# EAGLE schematic uCsamd21 (EAGLE 8.7.1)
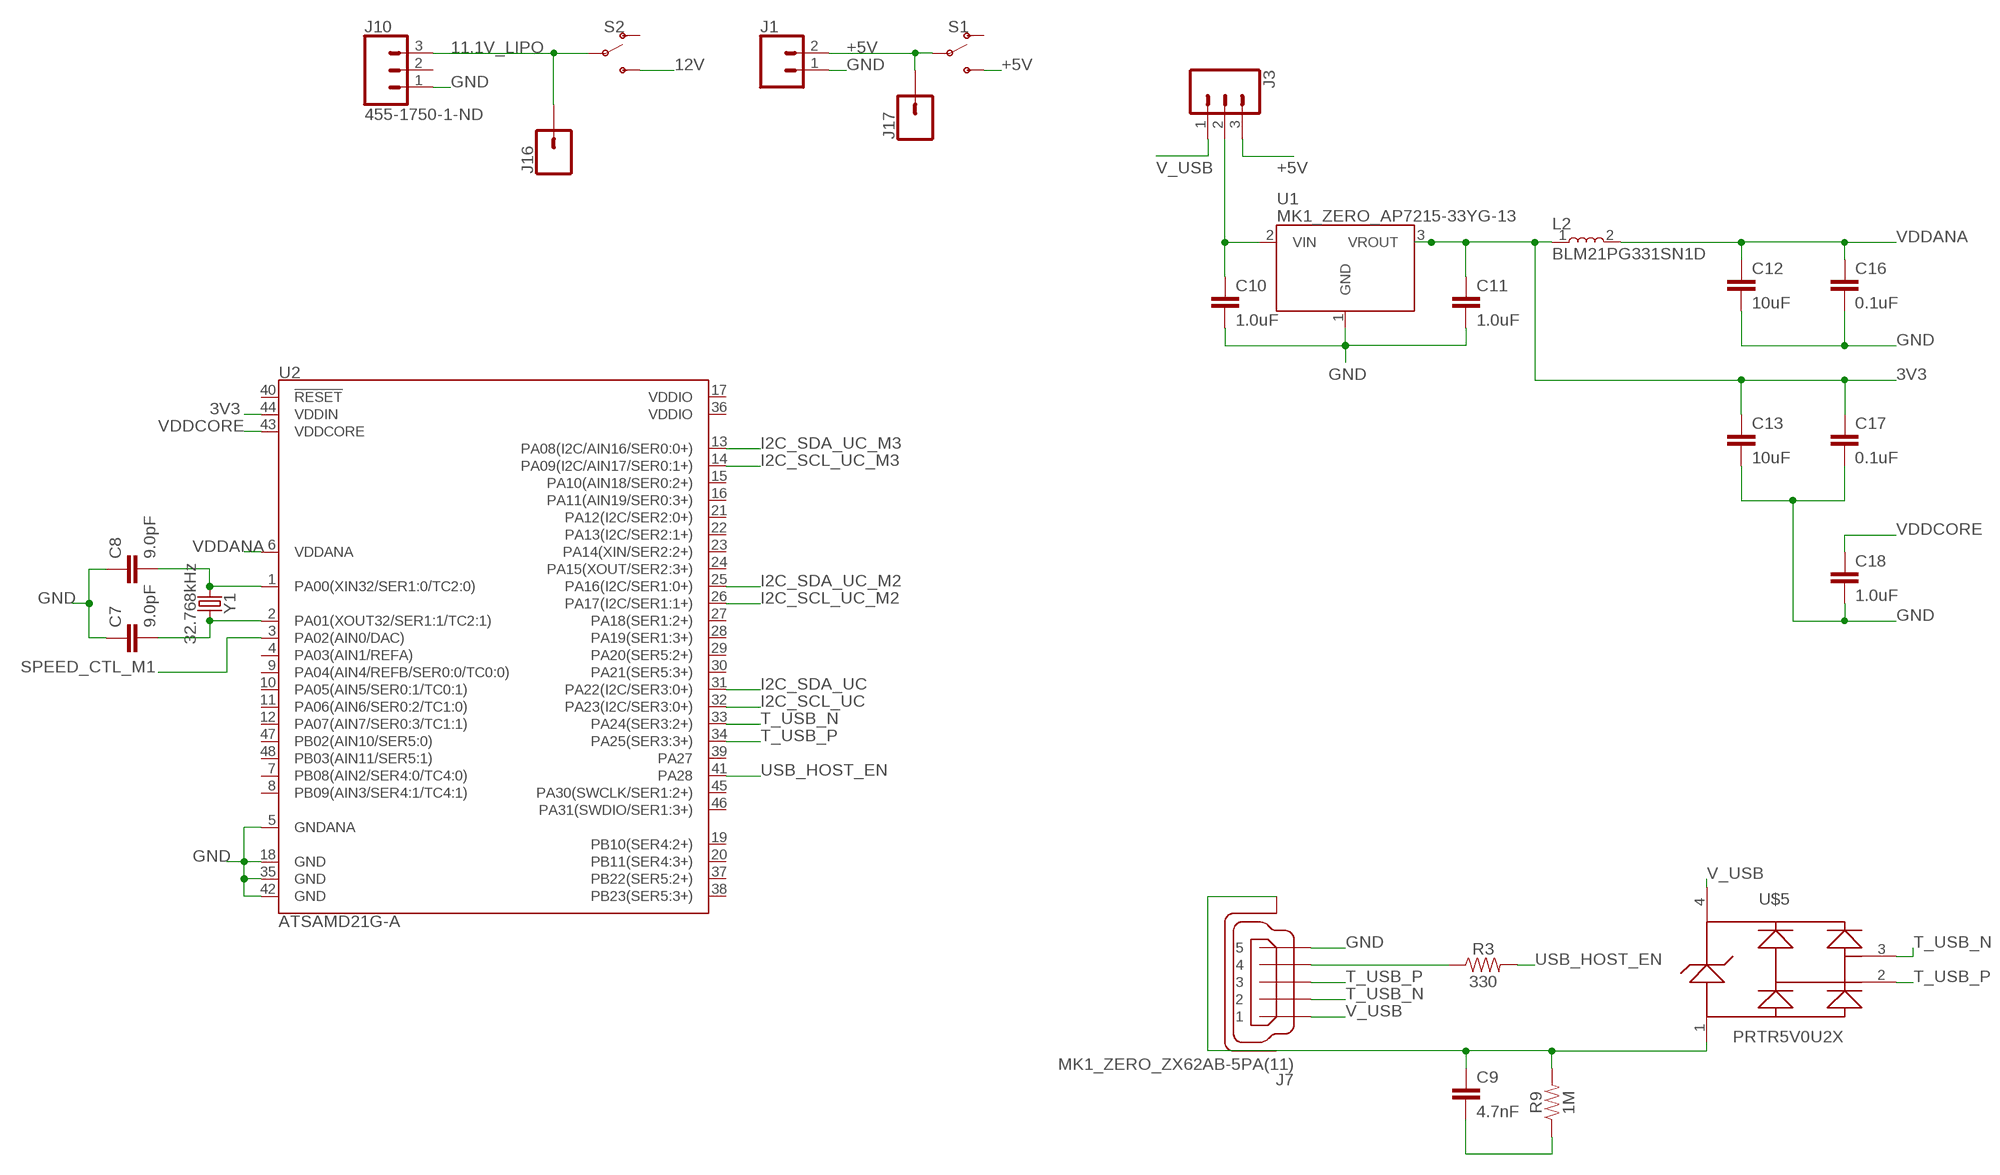
[diagram p0: schematic, sheet 1]

## Parts
C7  9.0pF  9.0PF-0603-50V-10%  [0603]
C8  9.0pF  9.0PF-0603-50V-10%  [0603]
C9  4.7nF  4.7PF-0603-50V-5%  [0603]
C10  1.0uF  1.0UF-0805-25V-(+80/-20%)  [0805]
C11  1.0uF  1.0UF-0805-25V-(+80/-20%)  [0805]
C12  10uF  10UF-0805-10V-10%  [0805]
C13  10uF  10UF-0805-10V-10%  [0805]
C16  0.1uF  1.0UF-0805-25V-(+80/-20%)  [0805]
C17  0.1uF  1.0UF-0805-25V-(+80/-20%)  [0805]
C18  1.0uF  1.0UF-0805-25V-(+80/-20%)  [0805]
J1  CONN_02LOCK_LONGPADS  [1X02_LOCK_LONGPADS]
J3  CONN_03LOCK_LONGPADS  [1X03_LOCK_LONGPADS]
J7  MK1_ZERO_ZX62AB-5PA(11)  [MK1_ZERO_USBMICRO-ZX62-AB-5PA]
J10  455-1750-1-ND  CONN_03  [1X03]
J16  CONN_01  [1X01]
J17  CONN_01  [1X01]
L2  BLM21PG331SN1D  [INDC2012X87]
R3  330  330OHM-0603-1/10W-1%  [0603]
R9  1M  1MOHM-0603-1/4W-5%  [0603]
S1  SWITCH-SPDT-PTH-11.6X4.0MM  [SWITCH_SPDT_PTH_11.6X4.0MM]
S2  SWITCH-SPDT-PTH-11.6X4.0MM  [SWITCH_SPDT_PTH_11.6X4.0MM]
U1  MK1_ZERO_AP7215-33YG-13  [MK1_ZERO_SOT150P400X160-3N]
U2  ATSAMD21G-A  [TQFP-48]
U$5  ARDUINO_PRTR5V0U2XB  [ARDUINO_SOT143B]
Y1  32.768kHz  CRYSTAL-32.768KHZSMD-3.2X1.5  [CRYSTAL-SMD-3.2X1.5MM]

## Nets
3V3: C11.1 C13.1 C17.1 L2.1 U1.3(VROUT) U2.44(VDDIN)
11.1V_LIPO: J10.3 J16.1 S2.2(P)
12V: S2.3(S)
+5V: J1.2 J3.3 J17.1 S1.2(P) S1.3(S)
GND: C7.1 C8.1 C10.2 C11.2 C12.2 C13.2 C16.2 C17.2 C18.2 J1.1 J7.5 J10.1 U1.1(GND) U2.5(GNDANA) U2.18(GND) U2.35(GND) U2.42(GND)
I2C_SCL_UC: U2.32(PA23(I2C/SER3:0+))
I2C_SCL_UC_M2: U2.26(PA17(I2C/SER1:1+))
I2C_SCL_UC_M3: U2.14(PA09(I2C/AIN17/SER0:1+))
I2C_SDA_UC: U2.31(PA22(I2C/SER3:0+))
I2C_SDA_UC_M2: U2.25(PA16(I2C/SER1:0+))
I2C_SDA_UC_M3: U2.13(PA08(I2C/AIN16/SER0:0+))
N$8: C7.2 U2.2(PA01(XOUT32/SER1:1/TC2:1)) Y1.P$2
N$10: C8.2 U2.1(PA00(XIN32/SER1:0/TC2:0)) Y1.P$1
N$12: J7.4
N$17: C9.1 J7.6(SH) J7.7(SH) J7.8(SH) J7.9(SH) J7.10(SH) J7.11(SH) R9.2 U$5.1
N$19: C9.2 R9.1
N$20: C10.1 J3.2 U1.2(VIN)
N$21: R3.1
SPEED_CTL_M1: U2.3(PA02(AIN0/DAC))
T_USB_N: J7.2 U2.33(PA24(SER3:2+)) U$5.3
T_USB_P: J7.3 U2.34(PA25(SER3:3+)) U$5.2
USB_HOST_EN: R3.2 U2.41(PA28)
V_USB: J3.1 J7.1 U$5.4
VDDANA: C12.1 C16.1 L2.2 U2.6(VDDANA)
VDDCORE: C18.1 U2.43(VDDCORE)
Unconnected: J10.2 S1.1(O) S2.1(O) U2.4(PA03(AIN1/REFA)) U2.7(PB08(AIN2/SER4:0/TC4:0)) U2.8(PB09(AIN3/SER4:1/TC4:1)) U2.9(PA04(AIN4/REFB/SER0:0/TC0:0)) U2.10(PA05(AIN5/SER0:1/TC0:1)) U2.11(PA06(AIN6/SER0:2/TC1:0)) U2.12(PA07(AIN7/SER0:3/TC1:1)) U2.15(PA10(AIN18/SER0:2+)) U2.16(PA11(AIN19/SER0:3+)) U2.17(VDDIO) U2.19(PB10(SER4:2+)) U2.20(PB11(SER4:3+)) U2.21(PA12(I2C/SER2:0+)) U2.22(PA13(I2C/SER2:1+)) U2.23(PA14(XIN/SER2:2+)) U2.24(PA15(XOUT/SER2:3+)) U2.27(PA18(SER1:2+)) U2.28(PA19(SER1:3+)) U2.29(PA20(SER5:2+)) U2.30(PA21(SER5:3+)) U2.36(VDDIO) U2.37(PB22(SER5:2+)) U2.38(PB23(SER5:3+)) U2.39(PA27) U2.40(!RESET!) U2.45(PA30(SWCLK/SER1:2+)) U2.46(PA31(SWDIO/SER1:3+)) U2.47(PB02(AIN10/SER5:0)) U2.48(PB03(AIN11/SER5:1))

## Library data of the parts
C7 C8 = SparkFun-Capacitors:9.0PF: 9.0pF ceramic capacitors A capacitor is a passive two-terminal electrical component used to store electrical energy temporarily in an electric field.; PROD_ID: CAP-09341
C9 = SparkFun-Capacitors:4.7PF: 4.7pF ceramic capacitors A capacitor is a passive two-terminal electrical component used to store electrical energy temporarily in an electric field.; PROD_ID: CAP-07880; VALUE: 4.7pF
C10 C11 C18 = SparkFun-Capacitors:1.0UF: 1µF ceramic capacitors A capacitor is a passive two-terminal electrical component used to store electrical energy temporarily in an electric field.; PROD_ID: CAP-11625
C12 C13 = SparkFun-Capacitors:10UF: 10.0µF ceramic capacitors A capacitor is a passive two-terminal electrical component used to store electrical energy temporarily in an electric field.; PROD_ID: CAP-11330
C16 C17 = SparkFun-Capacitors:1.0UF: 1µF ceramic capacitors A capacitor is a passive two-terminal electrical component used to store electrical energy temporarily in an electric field.; PROD_ID: CAP-11625; VALUE: 1.0uF
J1 = SparkFun-Connectors:CONN_02: Multi connection point. Often used as Generic Header-pin footprint for 0.1 inch spaced/style header connections On any of the 0.1 inch spaced packages, you can populate with these: Break Away Headers - Straight <https://www.sparkfun.com/products/116> (PRT-00116) Break Away Male Headers - Right Angle <https://www.sparkfun.com/products/553> (PRT-00553) Female Headers <https://www.sparkfun.com/products/115> (PRT-00115) Break Away Headers - Machine Pin <https://www.sparkfun.com/products/117> (PRT-00117) Break Away Female Headers - Swiss Machine Pin <https://www.sparkfun.com/products/743> (PRT-00743) For SCREWTERMINALS and SPRING TERMINALS visit here: Screw Terimnals on SparkFun.com <https://www.sparkfun.com/search/results?term=Screw+Terminals> (5mm/3.5mm/2.54mm spacing) This device is also useful as a general connection point to wire up your design to another part of your project. Our various solder wires solder well into these plated through hole pads. Hook-Up Wire - Assortment (Stranded, 22 AWG) <https://www.sparkfun.com/products/11375> (PRT-11375) Hook-Up Wire - Assortment (Solid Core, 22 AWG) <https://www.sparkfun.com/products/11367> (PRT-11367) View the entire wire category on our website here <https://www.sparkfun.com/categories/141> Special notes: Molex polarized connector foot print use with: PRT-08233 with associated crimp pins and housings. 2.54_SCREWTERM for use with PRT-10571. 3.5mm Screw Terminal footprints for PRT-08084 5mm Screw Terminal footprints for use with PRT-08432
J3 = SparkFun-Connectors:CONN_03: Multi connection point. Often used as Generic Header-pin footprint for 0.1 inch spaced/style header connections On any of the 0.1 inch spaced packages, you can populate with these: Break Away Headers - Straight <https://www.sparkfun.com/products/116> (PRT-00116) Break Away Male Headers - Right Angle <https://www.sparkfun.com/products/553> (PRT-00553) Female Headers <https://www.sparkfun.com/products/115> (PRT-00115) Break Away Headers - Machine Pin <https://www.sparkfun.com/products/117> (PRT-00117) Break Away Female Headers - Swiss Machine Pin <https://www.sparkfun.com/products/743> (PRT-00743) Stackable Header - 3 Pin (Female, 0.1") <https://www.sparkfun.com/products/13875> (PRT-13875) For SCREWTERMINALS and SPRING TERMINALS visit here: Screw Terimnals on SparkFun.com <https://www.sparkfun.com/search/results?term=Screw+Terminals> (5mm/3.5mm/2.54mm spacing) This device is also useful as a general connection point to wire up your design to another part of your project. Our various solder wires solder well into these plated through hole pads. Hook-Up Wire - Assortment (Stranded, 22 AWG) <https://www.sparkfun.com/products/11375> (PRT-11375) Hook-Up Wire - Assortment (Solid Core, 22 AWG) <https://www.sparkfun.com/products/11367> (PRT-11367) View the entire wire category on our website here <https://www.sparkfun.com/categories/141> Special notes: Molex polarized connector foot print use with SKU : PRT-08232 with associated crimp pins and housings.
J7 = MKRZero_V5.0:MK1_ZERO_ZX62AB-5PA(11)
J10 = SparkFun-Connectors:CONN_03: Multi connection point. Often used as Generic Header-pin footprint for 0.1 inch spaced/style header connections On any of the 0.1 inch spaced packages, you can populate with these: Break Away Headers - Straight <https://www.sparkfun.com/products/116> (PRT-00116) Break Away Male Headers - Right Angle <https://www.sparkfun.com/products/553> (PRT-00553) Female Headers <https://www.sparkfun.com/products/115> (PRT-00115) Break Away Headers - Machine Pin <https://www.sparkfun.com/products/117> (PRT-00117) Break Away Female Headers - Swiss Machine Pin <https://www.sparkfun.com/products/743> (PRT-00743) Stackable Header - 3 Pin (Female, 0.1") <https://www.sparkfun.com/products/13875> (PRT-13875) For SCREWTERMINALS and SPRING TERMINALS visit here: Screw Terimnals on SparkFun.com <https://www.sparkfun.com/search/results?term=Screw+Terminals> (5mm/3.5mm/2.54mm spacing) This device is also useful as a general connection point to wire up your design to another part of your project. Our various solder wires solder well into these plated through hole pads. Hook-Up Wire - Assortment (Stranded, 22 AWG) <https://www.sparkfun.com/products/11375> (PRT-11375) Hook-Up Wire - Assortment (Solid Core, 22 AWG) <https://www.sparkfun.com/products/11367> (PRT-11367) View the entire wire category on our website here <https://www.sparkfun.com/categories/141> Special notes: Molex polarized connector foot print use with SKU : PRT-08232 with associated crimp pins and housings.; PROD_ID: XXX-00000
J16 J17 = SparkFun-Connectors:CONN_01: Single connection point. Often used as Generic Header-pin footprint for 0.1 inch spaced/style header connections On any of the 0.1 inch spaced packages, you can populate with these: Break Away Headers - Straight <https://www.sparkfun.com/products/116> (PRT-00116) Break Away Male Headers - Right Angle <https://www.sparkfun.com/products/553> (PRT-00553) Female Headers <https://www.sparkfun.com/products/115> (PRT-00115) Break Away Headers - Machine Pin <https://www.sparkfun.com/products/117> (PRT-00117) Break Away Female Headers - Swiss Machine Pin <https://www.sparkfun.com/products/743> (PRT-00743) This device is also useful as a general connection point to wire up your design to another part of your project. Our various solder wires solder well into these plated through hole pads. Hook-Up Wire - Assortment (Stranded, 22 AWG) <https://www.sparkfun.com/products/11375> (PRT-11375) Hook-Up Wire - Assortment (Solid Core, 22 AWG) <https://www.sparkfun.com/products/11367> (PRT-11367) View the entire wire category on our website here <https://www.sparkfun.com/categories/141> Special notes: SMTSO-256-ET is a "flush mount" nut for a 4-40 screw. We mostly use this on specialty testbeds; it is a nice way to connect hardware to your PCB at an adjustable hieght. Also note, the SNAP packages are for using a snappable style connector. We sell a baggie of snaps and they are also used on two LilyPad designs: Snap Assortment - 30 pack (male and female) <https://www.sparkfun.com/products/11347> (DEV-11347) LilyPad Arduino SimpleSnap <https://www.sparkfun.com/products/10941> (DEV-10941) LilyPad SimpleSnap Protoboard <https://www.sparkfun.com/products/10940> (DEV-10940)
L2 = Common-Parts-Library-Eagle:BLM21PG331SN1D: Ferrite Beads Multi-Layer 330Ohm 25% 100MHz 1.5A 70mOhm DCR 0805 Paper T/R; MANUFACTURER: MURATA
R3 = SparkFun-Resistors:330OHM: 330Ω resistor A resistor is a passive two-terminal electrical component that implements electrical resistance as a circuit element. Resistors act to reduce current flow, and, at the same time, act to lower voltage levels within circuits. - Wikipedia; PROD_ID: RES-00818
R9 = SparkFun-Resistors:1MOHM: 1MΩ resistor A resistor is a passive two-terminal electrical component that implements electrical resistance as a circuit element. Resistors act to reduce current flow, and, at the same time, act to lower voltage levels within circuits. - Wikipedia; PROD_ID: RES-07868
S1 S2 = SparkFun-Switches:SWITCH-SPDT: Single Pole, Double Throw (SPDT) Switch Single-pole, double-throw (SPDT) switch. Variant Overview SMD-AYZ0202 Surface Mount DPDT Switch <https://www.sparkfun.com/products/597> (COM-00597) Used on e.g. LilyPad Arduino USB - ATmega32U4 Board <https://www.sparkfun.com/products/12049> PTH-11.6X4.0MM SPDT Mini Power Switch <https://www.sparkfun.com/products/102> (COM-00102) Used on e.g. SparkFun Simon Says - Through-Hole Soldering Kit <https://www.sparkfun.com/products/10547> (KIT-10547) PTH-11.6X4.0MM-KIT KIT version of SPDT Mini Power Switch - Simplifies soldering by removing tStop of switch pins - only one side can be soldered. PTH-11.6X4.0MM-LOCK LOCK version of SPDT Mini Power Switch - Offset pins hold switch in place for easier soldering. SMD-RIGHT-ANGLE Surface Mount Right Angle Switch <https://www.sparkfun.com/products/10860> (COM-10860) Used on e.g. SparkFun ESP8266 Thing <https://www.sparkfun.com/products/13231>; PROD_ID: SWCH-08261; SF_SKU: COM-00102
U1 = MKRZero_V5.0:MK1_ZERO_AP7215-33YG-13: IC REG LDO 3.3V 0.6A SOT89-3 Datasheet <http://www.diodes.com/_files/datasheets/AP7215.pdf>; DESCR: IC REG LDO 3.3V 0.6A SOT89-3; MF: Diodes Inc; MPN: AP7215-33YG-13
U2 = SparkFun-IC-Microcontroller:ATSAMD21G: Atmel SAMD21G SMART ARM-Based Microcontroller The Atmel ® | SMART ™ SAM D21 is a series of low-power microcontrollers using the 32-bit ARM ® Cortex ® -M0+ processor, and ranging from 32- to 64-pins with up to 256KB Flash and 32KB of SRAM. The SAM D21 devices operate at a maximum frequency of 48MHz and reach 2.46 CoreMark/MHz. They are designed for simple and intuitive migration with identical peripheral modules, hex compatible code, identical linear address map and pin compatible migration paths between all devices in the product series. All devices include intelligent and flexible peripherals, Atmel Event System for inter-peripheral signaling, and support for capacitive touch button, slider and wheel user interfaces. Datasheet <https://cdn.sparkfun.com/datasheets/Dev/Arduino/Boards/Atmel-42181-SAM-D21_Datasheet.pdf> SparkFun Products SparkFun SAMD21 Mini Breakout <https://www.sparkfun.com/products/13664> (DEV-13664) SparkFun SAMD21 Dev Breakout <https://www.sparkfun.com/products/13672> (DEV-13672); PROD_ID: IC-13064
U$5 = Zero_V1.0:ARDUINO_PRTR5V0U2X
Y1 = SparkFun-Clocks:CRYSTAL-32.768KHZ: 32.768kHz Crystal Frequency: 32.768kHz Frequency Stability: ±20ppm Load Capacitance: 12.5pF (PTH-2X6 & SMD-3.2X1.5), 6pF (SMD-2X6) SparkFun Products: SparkFun BigTime Watch Kit <https://www.sparkfun.com/products/11734> SparkFun nRF52832 Breakout <https://www.sparkfun.com/products/13990> SparkFun Real Time Clock Module <https://www.sparkfun.com/products/12708>; PROD_ID: XTAL-13062